# Altium schematic sheet NARION_平水仪_20250120).SchDoc
size A4; Organization: Altium Limited; Address1: L3, 12a Rodborough Rd; Address2: Frenchs Forest; Address3: NSW; Address4: Australia 2086
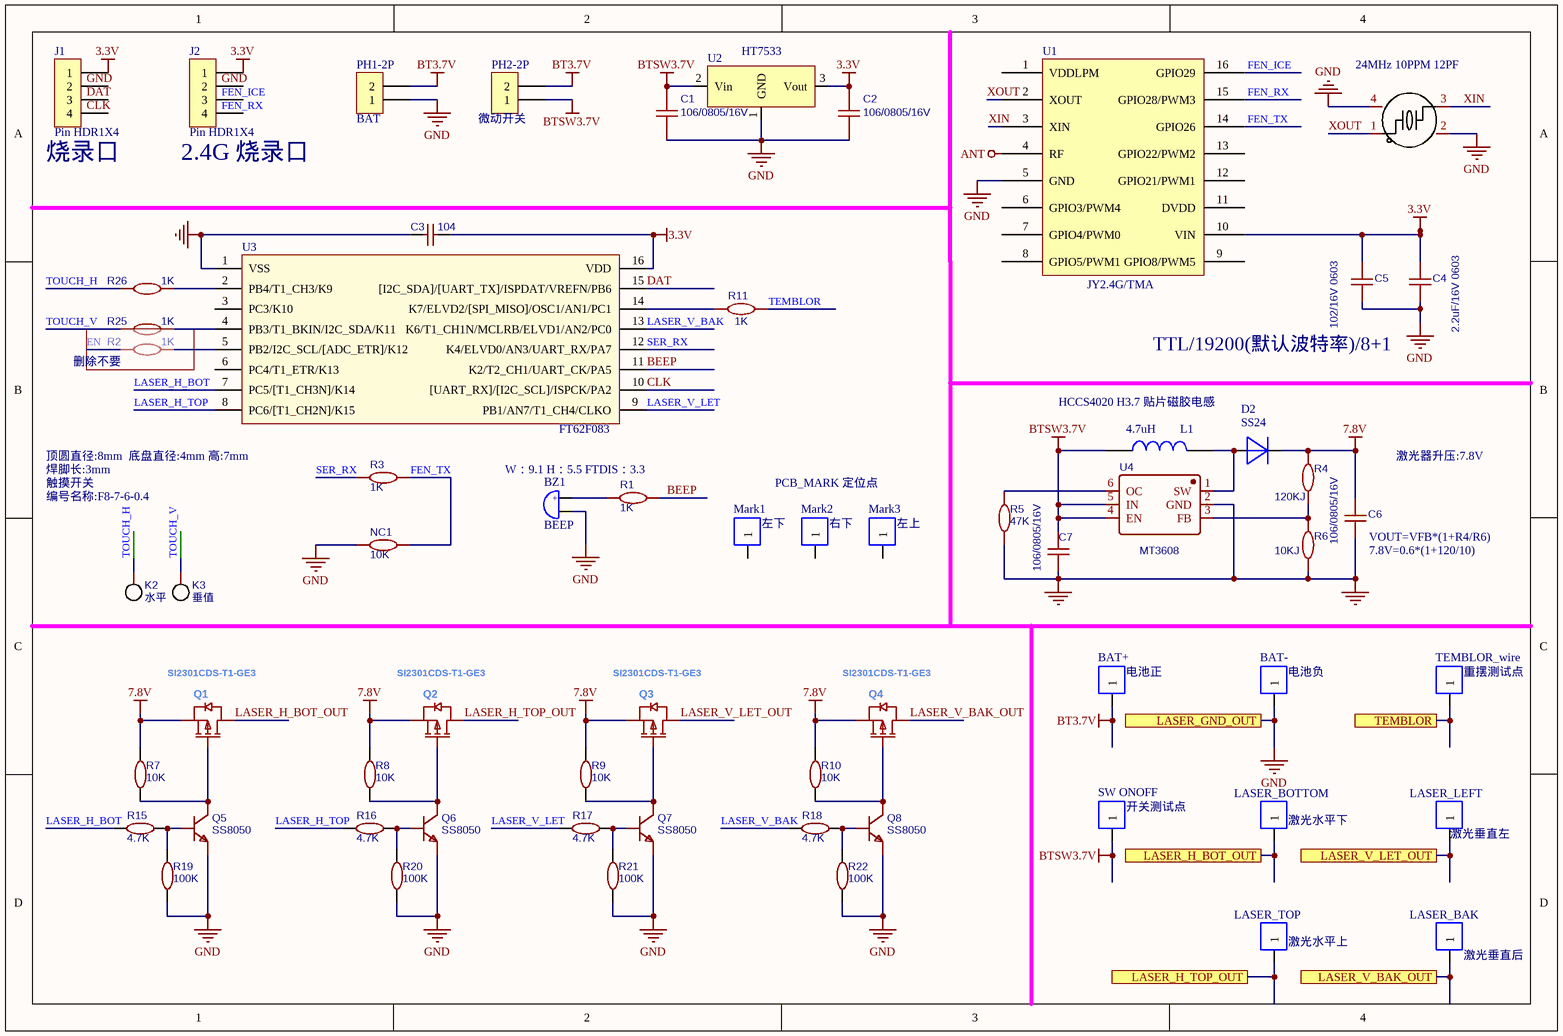
[diagram p0: NARION_平水仪_20250120).SchDoc]

## Parts
BAT+  电池正  [MARK]
BAT-  电池负  [PIN-1-1.0X0.5-SMD]
BZ1  BEEP  [BUZ-TH_BD9.6-P5.00-D0.7-FD]
C1  106/0805/16V  [0805_c]
C2  106/0805/16V  [0805_c]
C3  104  [0603_C]
C4  2.2uF/16V 0603  [SMT-0603C]
C5  102/16V 0603  [SMT-0603C]
C6  106/0805/16V  [0805_C]
C7  106/0805/16V  [0603_C]
D2  SS24  [SMT-DO-214AC]
J1  Pin HDR1X4  [烧录口]
J2  Pin HDR1X4  [烧录口]
K2  水平  [F8*10触摸弹簧]
K3  垂值  [F8*10触摸弹簧]
L1  4.7uH  [IND-SMD_L4.0-W4.0_FNR40XXS]
LASER_BAK  激光垂直后  [PIN-1-1.0X0.5-SMD]
LASER_BOTTOM  激光水平下  [PIN-1-1.0X0.5-SMD]
LASER_LEFT  激光垂直左  [PIN-1-1.0X0.5-SMD]
LASER_TOP  激光水平上  [PIN-1-1.0X0.5-SMD]
Mark1  左下  [MARK]
Mark2  右下  [MARK]
Mark3  左上  [MARK]
NC1  10K  [0603]
PH1-2P  BAT  [MI-PH2-2.0]
PH2-2P  微动开关  [MI-PH2-2.0]
Q1  SI2301CDS-T1-GE3  [SOT-23]
Q2  SI2301CDS-T1-GE3  [SOT-23]
Q3  SI2301CDS-T1-GE3  [SOT-23]
Q4  SI2301CDS-T1-GE3  [SOT-23]
Q5  SS8050  [SOT-23]
Q6  SS8050  [SOT-23]
Q7  SS8050  [SOT-23]
Q8  SS8050  [SOT-23]
R1  1K  [0603]
R2  1K  [0603]
R3  1K  [0603]
R4  120KJ  [0603_R]
R5  47K  [0603_R]
R6  10KJ  [0603_R]
R7  10K  [0603_R]
R8  10K  [0603_R]
R9  10K  [0603_R]
R10  10K  [0603_R]
R11  1K  [0603]
R15  4.7K  [0603_R]
R16  4.7K  [0603_R]
R17  4.7K  [0603_R]
R18  4.7K  [0603_R]
R19  100K  [0603_R]
R20  100K  [0603_R]
R21  100K  [0603_R]
R22  100K  [0603_R]
R25  1K  [0603]
R26  1K  [0603]
SW_ONOFF  开关测试点  [MARK]
TEMBLOR_wire  重摆测试点  [MARK]
U1  JY2.4G/TMA  [SOP16]
U2  HT7533  [SOT-23(SOT-23-3)]
U3  FT62F083  [SOP16]
U4  MT3608  [SOT-23-6]
X1  X32258MOB4SI  [CRY-D3225]  (value not drawn)

## Ports
LASER_GND_OUT, LASER_H_BOT_OUT, LASER_H_TOP_OUT, LASER_V_BAK_OUT, LASER_V_LET_OUT, TEMBLOR

## Nets
3.3V: C2.2 C3.1 C4.2 C5.2 J1.1 J2.1 U1.10(VIN) U2.3(Vout) U3.16(VDD)
7.8V: C6.1 D2.2 Q1.2(S) Q2.2(S) Q3.2(S) Q4.2(S) R4.2 R7.2 R8.2 R9.2 R10.2
ANT: U1.4(RF)
BT3.7V: BAT+.1 PH1-2P.2 PH2-2P.2
BTSW3.7V: C1.2 C7.1 L1.1 PH2-2P.1 SW_ONOFF.1 U2.2(Vin) U4.4(EN) U4.5(IN)
GND: BAT-.1 BZ1.2 C1.1 C2.1 C3.2 C4.1 C5.1 C6.2 C7.2 NC1.1 PH1-2P.1 Q5.2(E) Q6.2(E) Q7.2(E) Q8.2(E) R5.1 R6.1 R19.2 R20.2 R21.2 R22.2 U1.5(GND) U2.1(GND) U3.1(VSS) U4.2(GND) X1.2(GND) X1.4(GND) ; port LASER_GND_OUT
BEEP: R1.2 U3.11(K2/T2_CH1/UART_CK/PA5)
CLK: U3.10([UART_RX]/[I2C_SCL]/ISPCK/PA2)
DAT: U3.15([I2C_SDA]/[UART_TX]/ISPDAT/VREFN/PB6)
EN: R2.1
FEN_ICE: U1.16(GPIO29)
FEN_RX: U1.15(GPIO28/PWM3)
FEN_TX: NC1.2 R3.2 U1.14(GPIO26)
LASER_H_BOT: R15.2 U3.7(PC5/[T1_CH3N]/K14)
LASER_H_BOT_OUT: Q1.3(D)
LASER_H_BOT_OUT: LASER_BOTTOM.1 ; port LASER_H_BOT_OUT  [a separate net that carries the same name]
LASER_H_TOP: R16.2 U3.8(PC6/[T1_CH2N]/K15)
LASER_H_TOP_OUT: Q2.3(D)
LASER_H_TOP_OUT: LASER_TOP.1 ; port LASER_H_TOP_OUT  [a separate net that carries the same name]
LASER_V_BAK: R18.2 U3.13(K6/T1_CH1N/MCLRB/ELVD1/AN2/PC0)
LASER_V_BAK_OUT: Q4.3(D)
LASER_V_BAK_OUT: LASER_BAK.1 ; port LASER_V_BAK_OUT  [a separate net that carries the same name]
LASER_V_LET: R17.2 U3.9(PB1/AN7/T1_CH4/CLKO)
LASER_V_LET_OUT: Q3.3(D)
LASER_V_LET_OUT: LASER_LEFT.1 ; port LASER_V_LET_OUT  [a separate net that carries the same name]
SER_RX: R3.1 U3.12(K4/ELVD0/AN3/UART_RX/PA7)
TEMBLOR: TEMBLOR_wire.1 ; port TEMBLOR
TEMBLOR: R11.2  [a separate net that carries the same name]
TOUCH_H: K2.1 R26.1
TOUCH_V: K3.1 R25.1
XIN: U1.3(XIN) X1.3(XOUT)
XOUT: U1.2(XOUT) X1.1(XIN)
NetBZ1_1: BZ1.1 R1.1
NetD2_1: D2.1 L1.2 U4.1(SW)
NetQ1_1: Q1.1(G) Q5.3(C) R7.1
NetQ2_1: Q2.1(G) Q6.3(C) R8.1
NetQ3_1: Q3.1(G) Q7.3(C) R9.1
NetQ4_1: Q4.1(G) Q8.3(C) R10.1
NetQ5_1: Q5.1(B) R15.1 R19.1
NetQ6_1: Q6.1(B) R16.1 R20.1
NetQ7_1: Q7.1(B) R17.1 R21.1
NetQ8_1: Q8.1(B) R18.1 R22.1
NetR2_2: R2.2 U3.5(PB2/I2C_SCL/[ADC_ETR]/K12)
NetR4_1: R4.1 R6.2 U4.3(FB)
NetR5_2: R5.2 U4.6(OC)
NetR11_1: R11.1 U3.14(K7/ELVD2/[SPI_MISO]/OSC1/AN1/PC1)
NetR25_2: R25.2 U3.4(PB3/T1_BKIN/I2C_SDA/K11)
NetR26_2: R26.2 U3.2(PB4/T1_CH3/K9)

Not connected (* = marked no-connect by the designer): J1 2 3 4; J2 2 3 4; Mark1 1; Mark2 1; Mark3 1; U1 1(VDDLPM) 6(GPIO3/PWM4) 7(GPIO4/PWM0) 8(GPIO5/PWM1) 9(GPIO8/PWM5) 11(DVDD) 12(GPIO21/PWM1) 13(GPIO22/PWM2); U3 3(PC3/K10) 6(PC4/T1_ETR/K13)

## Notes on the sheet
- (near X1) 24MHz 10PPM 12PF
- (near J1) 烧录口
- (near J2) 2.4G 烧录口
- 删除不要
- TTL/19200(默认波特率)/8+1
- (near L1) HCCS4020 H3.7 贴片磁胶电感
- 焊脚长:3mm
- 编号名称:F8-7-6-0.4
- 顶圆直径:8mm  底盘直径:4mm 高:7mm
- 触摸开关
- W：9.1 H：5.5 FTDIS：3.3
- PCB_MARK 定位点
- 激光器升压:7.8V
- (near C6) VOUT=VFB*(1+R4/R6)
- (near C6) 7.8V=0.6*(1+120/10)
- Labels drawn without touching a wire or pin: CLK, DAT, FEN_ICE, FEN_RX, GND
- Title
- Size:
- Date:
- A4
- Number:
- Time:
- Revision:
- Sheet
- of
- File:
- (in symbol BEEP) +

## Library data of the parts
BAT+ BAT- LASER_BAK LASER_BOTTOM LASER_LEFT LASER_TOP Mark1-Mark3 SW_ONOFF TEMBLOR_wire = 1P
BZ1 = BEEP: 蜂鸣器
C1 C2 = 102/400V: BOM_Manufacturer: SAMSUNG; BOM_Manufacturer Part: CL10B104KA8NNNC; nameAlias: Capacitance; BOM_Supplier: LCSC; BOM_Supplier Part: C1590; spicePre: C; spiceSymbolName: CL10B104KA8NNNC
C3 = 104: BOM_Manufacturer: MuRata; BOM_Manufacturer Part: GCM155R71E104KE02D; nameAlias: Capacitance; BOM_Supplier: LCSC; BOM_Supplier Part: C126527; spicePre: C; spiceSymbolName: GCM155R71E104KE02D
C4 C5 = 100nF: 0603; BOM_Manufacturer: Walsin Tech Corp; BOM_Manufacturer Part: 0402X224J100CT; nameAlias: Capacitance; Contributor: LCSC; BOM_Supplier: LCSC; BOM_Supplier Part: C295939; spicePre: C; spiceSymbolName: 0402X224J100CT
C6 C7 = 100nF: BOM_Manufacturer: Walsin Tech Corp; BOM_Manufacturer Part: 0402X224J100CT; nameAlias: Capacitance; Contributor: LCSC; BOM_Supplier: LCSC; BOM_Supplier Part: C295939; spicePre: C; spiceSymbolName: 0402X224J100CT
D2 = Diode
K2 K3 = (no symbol name): BOM_Manufacturer: null; Contributor: LCSC; BOM_Supplier: LCSC; BOM_Supplier Part: C9900000008; BOM_JLCPCB Part Class: Extended Part; spicePre: U
L1 = INDUCTOR
NC1 R1-R3 R11 R25 R26 = 300K: BOM_Manufacturer: Tyohm; BOM_Manufacturer Part: RMC04024.7K1%N; nameAlias: Resistance (Ohms); Contributor: LCSC; BOM_Supplier: LCSC; BOM_Supplier Part: C270129; spicePre: R; spiceSymbolName: RMC04024.7K1%N
PH1-2P PH2-2P = XH2
Q1-Q4 = SI2301CDS-T1-GE3: Manufacturer: VISHAY(威世); Add into BOM: yes; Type: 1个P沟道; Drain Source Voltage (Vdss): 20V; Continuous Drain Current (Id): 2.3A; Drain Source On Resistance (RDS(on)@Vgs,Id): 112mΩ@4.5V,2.8A; Power Dissipation (Pd): 860mW; Gate Threshold Voltage (Vgs(th)@Id): 1V@250uA; Total Gate Charge (Qg@Vgs): 3.3nC@10V; Input Capacitance (Ciss@Vds): 405pF@10V; Reverse Transfer Capacitance (Crss@Vds): 55pF@10V; Symbol: SI2301CDS-T1-GE3; Device: SI2301CDS-T1-GE3; LCSC Part Name: 1个P沟道 耐压:20V 电流:2.3A; Supplier Part: C10487; Manufacturer Part: SI2301CDS-T1-GE3; Supplier Footprint: SOT-23; JLCPCB Part Class: Basic Part; Datasheet: https://atta.szlcsc.com/upload/public/pdf/source/20180621/C10487_757133A2CC00440C4C7DD3E7E73681E9.pdf; Supplier: LCSC; Convert to PCB: yes; Operating Temperature: -55℃~+150℃
Q5-Q8 = S8050: BOM_Manufacturer: JSMSEMI; Contributor: LCSC; BOM_Supplier: LCSC; BOM_Supplier Part: C916390; BOM_Manufacturer Part: S8050; spicePre: Q; spiceSymbolName: S8050
R4-R6 = 100K: BOM_Manufacturer: YAGEO; BOM_Manufacturer Part: AC0805FR-073K48L; nameAlias: Resistance (Ohms); Contributor: LCSC; BOM_Supplier: LCSC; BOM_Supplier Part: C228794; spicePre: R; spiceSymbolName: 0805
R7-R10 R15-R22 = 51K: BOM_Manufacturer: UniOhm; BOM_Manufacturer Part: 0402WGJ0165TCE; nameAlias: Resistance (Ohms); BOM_Supplier: LCSC; BOM_Supplier Part: C57065; spicePre: R; spiceSymbolName: 0402WGJ0165TCE
U1 = Component_1: SOP16
U2 = IC HT7550
U4 = HTX1820: BOM_Manufacturer: FM; BOM_Manufacturer Part: 8205SS; BOM_Supplier: LCSC; BOM_Supplier Part: C108055; spicePre: Q; spiceSymbolName: 8205SS
X1 = X32258MOB4SI: 24MHz 10PPM 12PF; Manufacturer: YXC(扬兴晶振); Name: 8MHz; Add into BOM: yes; Crystal Type: 贴片无源晶振; Value: 8MHz; Frequency Stability: ±30ppm; Equivalent Series Resistance (ESR): 150Ω; Symbol: X32258MOB4SI; Device: X32258MOB4SI; LCSC Part Name: 8MHz ±10ppm 12pF YSX321SL; Supplier Part: C2682775; Manufacturer Part: X32258MOB4SI; Supplier Footprint: SMD3225-4P; JLCPCB Part Class: Extended Part; Datasheet: https://atta.szlcsc.com/upload/public/pdf/source/20210106/C2682774_0CD4FDA5D9DA3FBEEC23BD607A48E4B0.pdf; Supplier: LCSC; Convert to PCB: yes; Frequency Tolerance: ±10ppm; Load Capacitance: 12pF; Operating Temperature: -40℃~+85℃